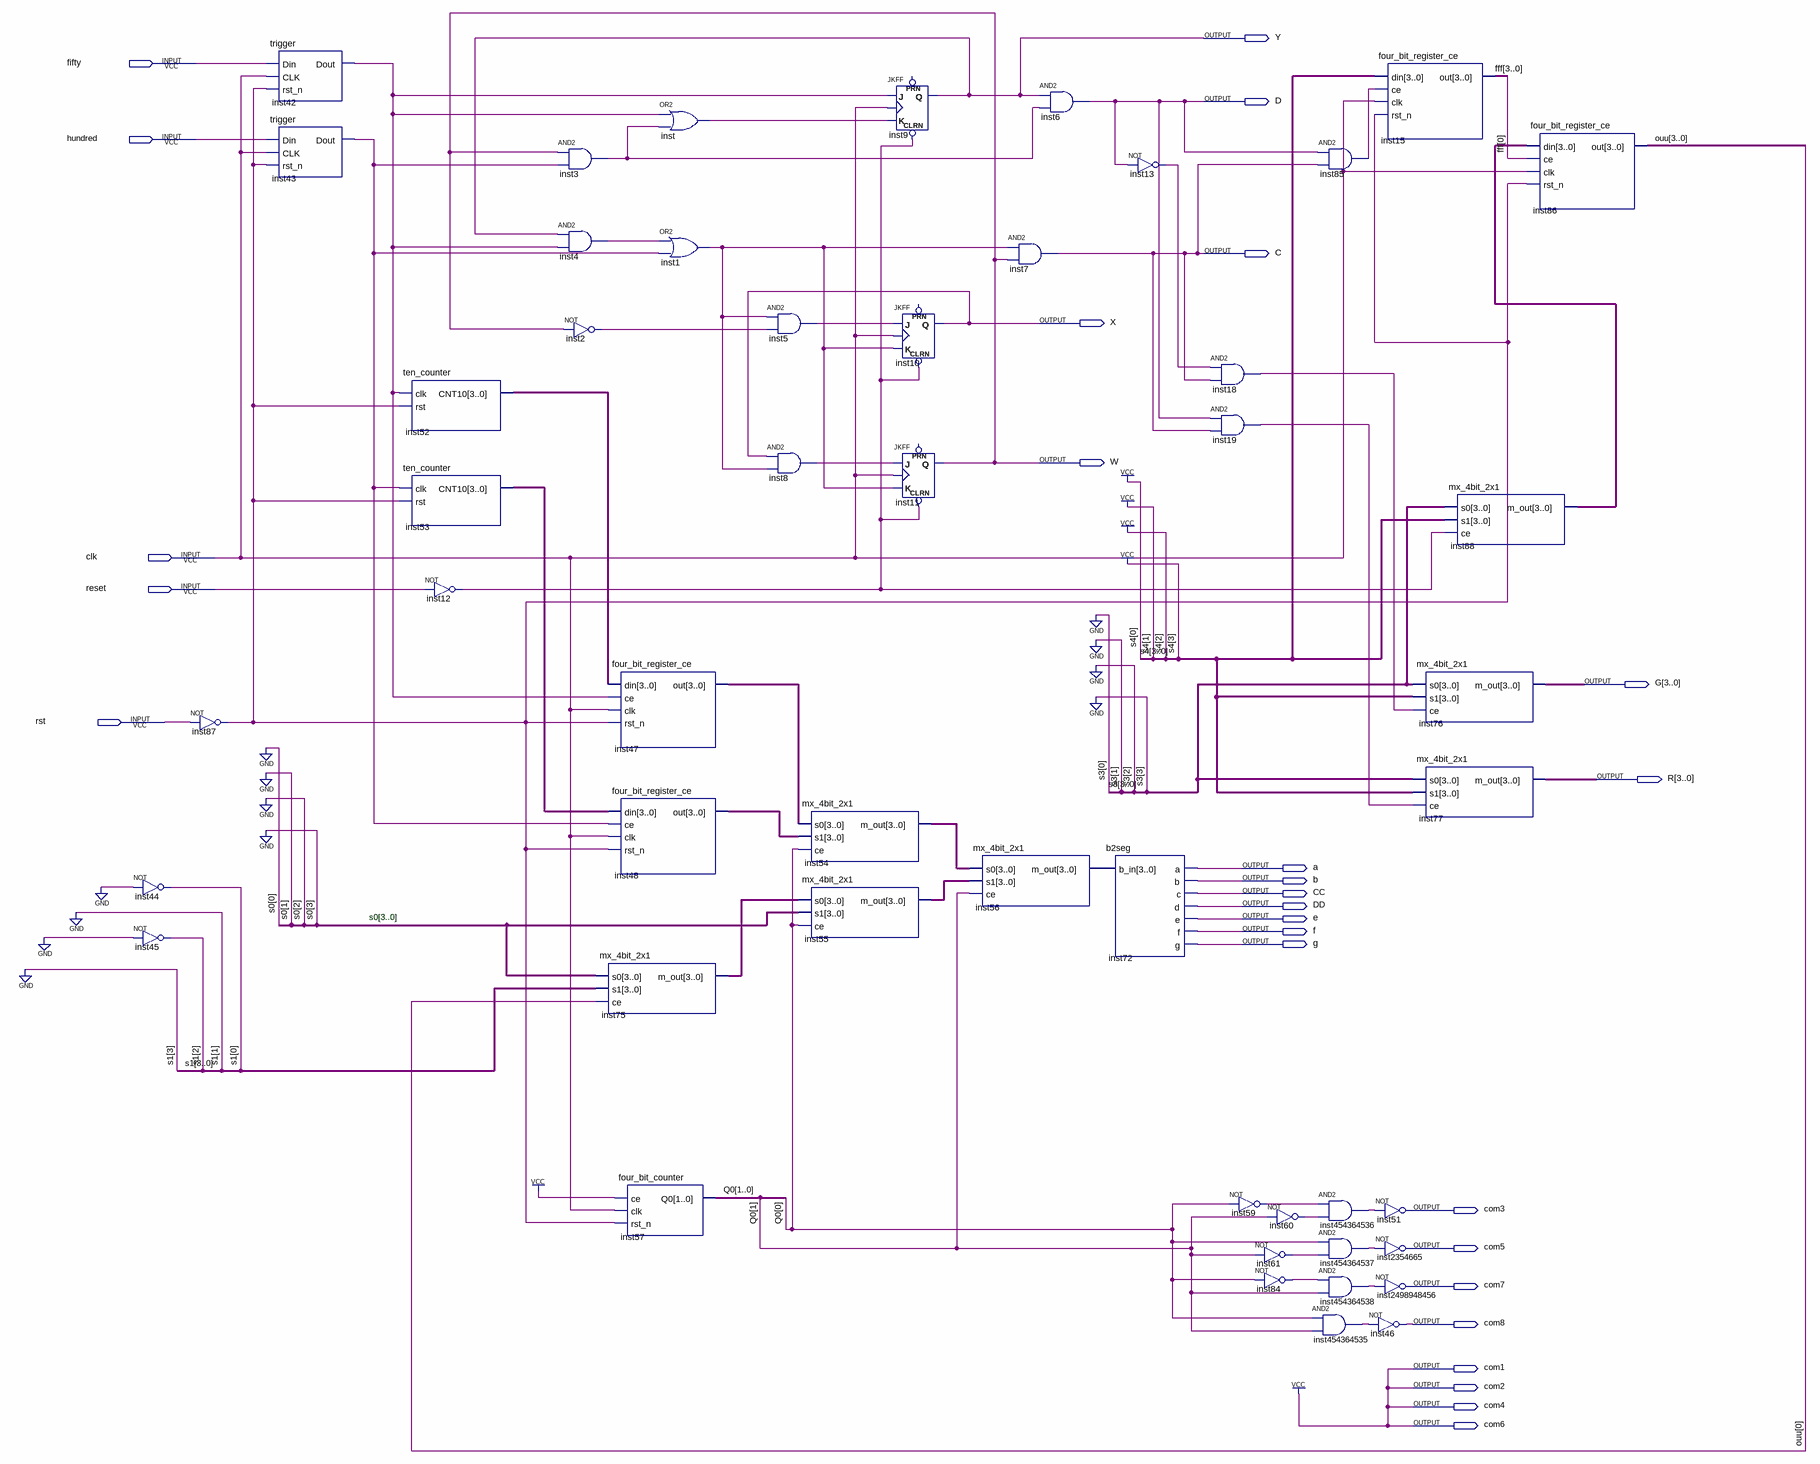
[diagram p0: schematic sheet]
// Quartus schematic real_final.bdf as structural Verilog: 49 symbols, 27 pins
module real_final (
  input  fifty,
  input  hundred,
  input  clk,
  input  reset,
  input  rst,
  output Y,
  output D,
  output C,
  output X,
  output W,
  output [3:0] G,
  output [3:0] R,
  output a,
  output b,
  output CC,
  output DD,
  output e,
  output f,
  output G_1bit,
  output com3,
  output com5,
  output com7,
  output com8,
  output com1,
  output com2,
  output com4,
  output com6
);

  wire inst1_out, inst2_out, inst3_out, inst4_out, inst5_out, inst8_out, inst12_out, inst13_out, inst18_out,
       inst19_out, inst42_dout, inst43_dout, inst59_out, inst60_out, inst61_out, inst84_out, inst85_out,
       inst87_out, inst454364535_out, inst454364536_out, inst454364537_out, inst454364538_out, inst_out;
  wire [1:0] Q0;
  wire [2:0] s1;
  wire [3:0] fff, inst47_out, inst48_out, inst52_cnt10, inst53_cnt10, inst54_m_out, inst55_m_out,
       inst56_m_out, inst75_m_out, inst88_m_out, ouu;

  not inst44 (s1[0], 1'b0);
  not inst45 (s1[2], 1'b0);
  not inst87 (inst87_out, rst);
  trigger inst42 (.Din(fifty), .CLK(clk), .rst_n(inst87_out), .Dout(inst42_dout));
  trigger inst43 (.Din(hundred), .CLK(clk), .rst_n(inst87_out), .Dout(inst43_dout));
  ten_counter inst52 (.clk(inst42_dout), .rst(inst87_out), .CNT10(inst52_cnt10));
  ten_counter inst53 (.clk(inst43_dout), .rst(inst87_out), .CNT10(inst53_cnt10));
  not inst12 (inst12_out, reset);
  and inst3 (inst3_out, W, inst43_dout);
  and inst4 (inst4_out, Y, inst42_dout);
  not inst2 (inst2_out, W);
  mx_4bit_2x1 inst75 (.s0(4'b0000), .s1({1'b0, s1[2], 1'b0, s1[0]}), .ce(ouu[0]), .m_out(inst75_m_out));
  four_bit_register_ce inst47 (.din(inst52_cnt10), .ce(inst42_dout), .clk(clk), .rst_n(inst87_out), .out(inst47_out));
  four_bit_register_ce inst48 (.din(inst53_cnt10), .ce(inst43_dout), .clk(clk), .rst_n(inst87_out), .out(inst48_out));
  four_bit_counter inst57 (.ce(1'b1), .clk(clk), .rst_n(inst87_out), .Q0(Q0));
  or inst (inst_out, inst42_dout, inst3_out);
  or inst1 (inst1_out, inst4_out, inst43_dout);
  and inst5 (inst5_out, inst1_out, inst2_out);
  and inst8 (inst8_out, X, inst1_out);
  mx_4bit_2x1 inst54 (.s0(inst47_out), .s1(inst48_out), .ce(Q0[0]), .m_out(inst54_m_out));
  mx_4bit_2x1 inst55 (.s0(inst75_m_out), .s1(4'b0000), .ce(Q0[0]), .m_out(inst55_m_out));
  JKFF inst9 (.CLRN(inst12_out), .K(inst_out), .J(inst42_dout), .CLK(clk), .Q(Y));  // open: PRN
  JKFF inst10 (.CLRN(inst12_out), .K(inst1_out), .J(inst5_out), .CLK(clk), .Q(X));  // open: PRN
  JKFF inst11 (.CLRN(inst12_out), .K(inst1_out), .J(inst8_out), .CLK(clk), .Q(W));  // open: PRN
  and inst7 (C, inst1_out, W);
  mx_4bit_2x1 inst56 (.s0(inst54_m_out), .s1(inst55_m_out), .ce(Q0[1]), .m_out(inst56_m_out));
  and inst6 (D, Y, inst3_out);
  b2seg inst72 (.b_in(inst56_m_out), .a(a), .b(b), .c(CC), .d(DD), .e(e), .f(f), .g(G_1bit));
  not inst13 (inst13_out, D);
  and inst18 (inst18_out, inst13_out, C);
  and inst19 (inst19_out, D, C);
  not inst59 (inst59_out, Q0[0]);
  not inst61 (inst61_out, Q0[1]);
  not inst84 (inst84_out, Q0[0]);
  not inst60 (inst60_out, Q0[1]);
  and inst454364535 (inst454364535_out, Q0[0], Q0[1]);
  and inst85 (inst85_out, D, C);
  and inst454364536 (inst454364536_out, inst59_out, inst60_out);
  and inst454364537 (inst454364537_out, Q0[0], inst61_out);
  and inst454364538 (inst454364538_out, inst84_out, Q0[1]);
  four_bit_register_ce inst15 (.din(4'b1111), .ce(inst85_out), .clk(clk), .rst_n(inst87_out), .out(fff));
  mx_4bit_2x1 inst76 (.s0(4'b0000), .s1(4'b1111), .ce(inst18_out), .m_out(G));
  mx_4bit_2x1 inst77 (.s0(4'b0000), .s1(4'b1111), .ce(inst19_out), .m_out(R));
  not inst51 (com3, inst454364536_out);
  not inst2354665 (com5, inst454364537_out);
  not inst2498948456 (com7, inst454364538_out);
  not inst46 (com8, inst454364535_out);
  mx_4bit_2x1 inst88 (.s0(4'b0000), .s1(4'b1111), .ce(inst12_out), .m_out(inst88_m_out));
  four_bit_register_ce inst86 (.din(inst88_m_out), .ce(fff[0]), .clk(clk), .rst_n(inst87_out), .out(ouu));

  assign com1 = 1'b1;
  assign com2 = 1'b1;
  assign com4 = 1'b1;
  assign com6 = 1'b1;

  // Notes on the sheet:
  //   s0[3..0]
endmodule
